# EAGLE design Plytka sterowania (EAGLE 4.11)
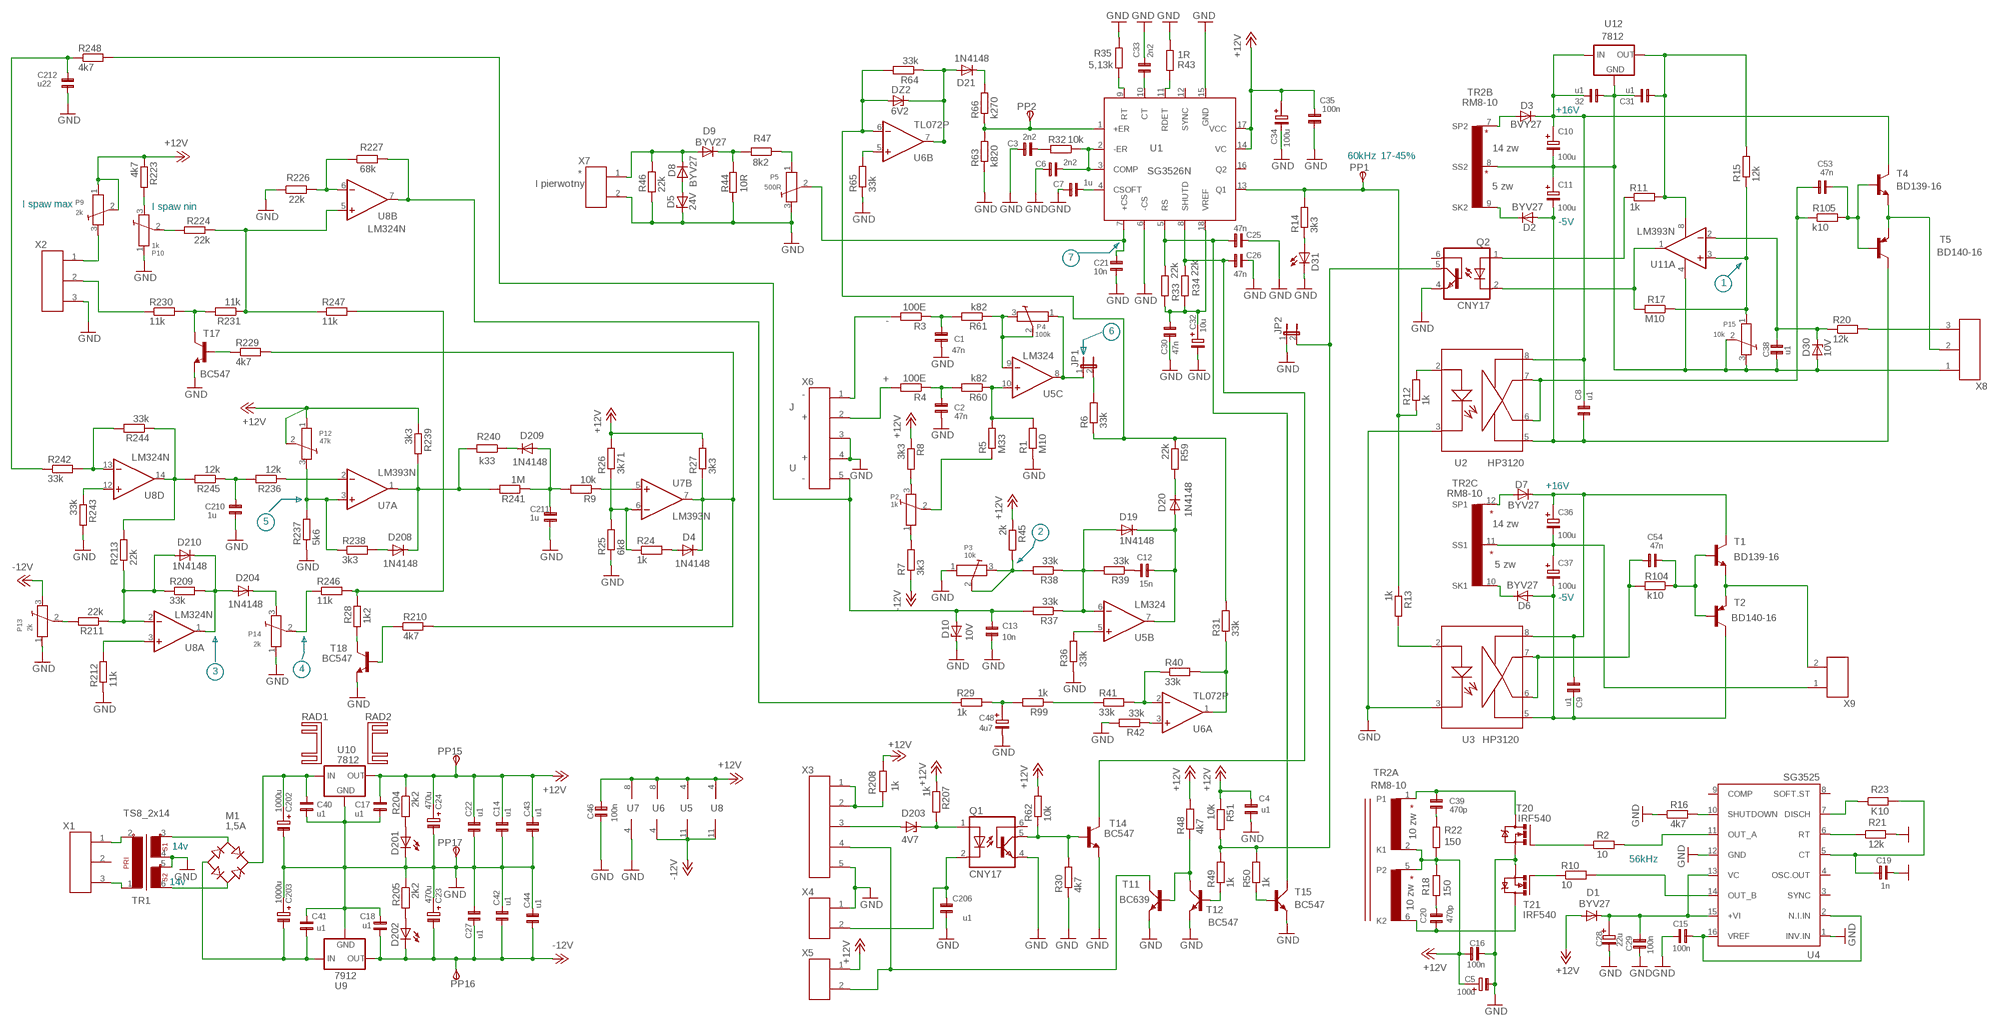
[diagram p0: schematic, sheet 1]

## Parts
32  u1  C5B3  [C5B3]
C1  47n  C5B3  [C5B3]
C2  47n  C5B3  [C5B3]
C3  2n2  C7,5B3  [C7,5B3]
C4  u1  C5B3  [C5B3]
C5  100u  E5-6  [E5-6]
C6  2n2  C7,5B3  [C7,5B3]
C7  1u  C5B5  [C5B5]
C8  u1  C5B3  [C5B3]
C9  u1  C5B3  [C5B3]
C10  100u  E5-6  [E5-6]
C11  100u  E5-6  [E5-6]
C12  15n  C5B3  [C5B3]
C13  10n  C5B3  [C5B3]
C14  u1  C5B2,5A  [C5B2,5A]
C15  100n  C5B2,5  [C5B2,5]
C16  100n  C5B2,5  [C5B2,5]
C17  u1  C5B3,5  [C5B3,5]
C18  u1  C5B3,5  [C5B3,5]
C19  1n  C5B2,5  [C5B2,5]
C20  470p  C2,5-3  [C2,5-3]
C21  10n  C5B2,5  [C5B2,5]
C22  u1  C5B2,5A  [C5B2,5A]
C23  470u  E5-10,5  [E5-10,5]
C24  470u  E5-10,5  [E5-10,5]
C25  47n  C5B2,5  [C5B2,5]
C26  47n  C5B2,5  [C5B2,5]
C27  u1  C5B2,5A  [C5B2,5A]
C28  22u  E2,5-6  [E2,5-6]
C29  100n  C5B2,5  [C5B2,5]
C30  47n  C5B2,5  [C5B2,5]
C31  u1  C5B3  [C5B3]
C32  10u  E5-5  [E5-5]
C33  2n2  C7,5B3  [C7,5B3]
C34  100u  E5-6  [E5-6]
C35  100n  C5B2,5  [C5B2,5]
C36  100u  E5-6  [E5-6]
C37  100u  E5-6  [E5-6]
C38  u1  C5B3  [C5B3]
C39  470p  C2,5-3  [C2,5-3]
C40  u1  C5B3,5  [C5B3,5]
C41  u1  C5B3,5  [C5B3,5]
C42  u1  C5B2,5A  [C5B2,5A]
C43  u1  C5B2,5A  [C5B2,5A]
C44  u1  C5B2,5A  [C5B2,5A]
C46  100n  C5B2,5  [C5B2,5]
C48  4u7  E2,5-5  [E2,5-5]
C53  47n  C5B3  [C5B3]
C54  47n  C5B3  [C5B3]
C202  1000u  E5-13  [E5-13]
C203  1000u  E5-13  [E5-13]
C206  u1  C5B3  [C5B3]
C210  1u  C5B5  [C5B5]
C211  1u  C5B5  [C5B5]
C212  u22  C5B3  [C5B3]
D1  BYV27  [SOD57-10]
D2  BYV27  [SOD57-10]
D3  BVY27  BYV27  [SOD57-10]
D4  1N4148  [DO35-10]
D5  24V  ZENER-DIODEDO41Z10  [DO41Z10]
D6  BYV27  [SOD57-10]
D7  BYV27  [SOD57-10]
D8  BYV27  [SOD57-10]
D9  BYV27  [SOD57-10]
D10  10V  ZENER-DIODEDO41Z10  [DO41Z10]
D19  1N4148  [DO35-10]
D20  1N4148  [DO35-10]
D21  1N4148  [DO35-10]
D30  10V  ZENER-DIODEDO41Z10  [DO41Z10]
D31  LED5MM  [LED5MM]
D201  LED5MM  [LED5MM]
D202  LED5MM  [LED5MM]
D203  4V7  ZENER-DIODEDO41Z10  [DO41Z10]
D204  1N4148  [DO35-10]
D208  1N4148  [DO35-10]
D209  1N4148  [DO35-10]
D210  1N4148  [DO35-10]
DZ2  6V2  ZENER-DIODEDO41Z10  [DO41Z10]
JP1  JP1E  [JP1]
JP2  JP1E  [JP1]
M1  1,5A  RECTIFIER-RB1A  [RB1A]
P2  1k  POT_MONT_W64_V  [W64_V]
P3  10k  POT_MONT_W64_V  [W64_V]
P4  100k  POT_MONT_W64_V  [W64_V]
P5  500R  POT_MONT_W64_V  [W64_V]
P9  2k  POT_MONT_W64_V  [W64_V]
P10  1k  POT_MONT_W64_V  [W64_V]
P12  47k  POT_MONT_W64_V  [W64_V]
P13  2k  POT_MONT_W64_V  [W64_V]
P14  2k  POT_MONT_W64_V  [W64_V]
P15  10k  POT_MONT_W64_V  [W64_V]
PP1  TPSPAD1-17  [P1-17]
PP2  TPSPAD1-17  [P1-17]
PP15  TPSPAD1-17  [P1-17]
PP16  TPSPAD1-17  [P1-17]
PP17  TPSPAD1-17  [P1-17]
Q1  CNY17  [DIL06]
Q2  CNY17  [DIL06]
R1  M10  R-EU_0309/10  [0309/10]
R2  10  R-EU_0207/10  [0207/10]
R3  100E  R-EU_0309/10  [0309/10]
R4  100E  R-EU_0309/10  [0309/10]
R5  M33  R-EU_0309/10  [0309/10]
R6  33k  R-EU_0309/10  [0309/10]
R7  3k3  R-EU_0309/10  [0309/10]
R8  3k3  R-EU_0309/10  [0309/10]
R9  10k  R-EU_0309/10  [0309/10]
R10  10  R-EU_0207/12  [0207/12]
R11  1k  R-EU_0309/10  [0309/10]
R12  1k  R-EU_0309/10  [0309/10]
R13  1k  R-EU_0309/10  [0309/10]
R14  3k3  R-EU_0309/10  [0309/10]
R15  12k  R-EU_0309/10  [0309/10]
R16  4k7  R-EU_0207/10  [0207/10]
R17  M10  R-EU_0309/10  [0309/10]
R18  150  R-EU_0207/10  [0207/10]
R20  12k  R-EU_0309/10  [0309/10]
R21  12k  R-EU_0207/10  [0207/10]
R22  150  R-EU_0207/10  [0207/10]
R23  K10  R-EU_0207/10  [0207/10]
R24  1k  R-EU_0309/10  [0309/10]
R25  6k8  R-EU_0309/10  [0309/10]
R26  3k71  R-EU_0309/10  [0309/10]
R27  3k3  R-EU_0309/10  [0309/10]
R28  1k2  R-EU_0309/10  [0309/10]
R29  1k  R-EU_0309/10  [0309/10]
R30  4k7  R-EU_0309/10  [0309/10]
R31  33k  R-EU_0309/10  [0309/10]
R32  10k  R-EU_0309/10  [0309/10]
R33  22k  R-EU_0309/10  [0309/10]
R34  22k  R-EU_0309/10  [0309/10]
R35  5,13k  R-EU_0309/10  [0309/10]
R36  33k  R-EU_0309/10  [0309/10]
R37  33k  R-EU_0309/10  [0309/10]
R38  33k  R-EU_0309/10  [0309/10]
R39  33k  R-EU_0309/10  [0309/10]
R40  33k  R-EU_0309/10  [0309/10]
R41  33k  R-EU_0309/10  [0309/10]
R42  33k  R-EU_0309/10  [0309/10]
R43  1R  R-EU_0309/10  [0309/10]
R44  10R  R-EU_0411/15  [0411/15]
R45  2k  R-EU_0309/10  [0309/10]
R46  22k  R-EU_0309/12  [0309/12]
R47  8k2  R-EU_0309/10  [0309/10]
R48  4k7  R-EU_0309/10  [0309/10]
R49  1k  R-EU_0309/10  [0309/10]
R50  1k  R-EU_0309/10  [0309/10]
R51  10k  R-EU_0309/10  [0309/10]
R59  22k  R-EU_0309/10  [0309/10]
R60  k82  R-EU_0309/10  [0309/10]
R61  k82  R-EU_0309/10  [0309/10]
R62  10k  R-EU_0309/10  [0309/10]
R63  k820  R-EU_0309/10  [0309/10]
R64  33k  R-EU_0309/10  [0309/10]
R65  33k  R-EU_0309/10  [0309/10]
R66  k270  R-EU_0309/10  [0309/10]
R99  1k  R-EU_0309/10  [0309/10]
R104  k10  R-EU_0309/10  [0309/10]
R105  k10  R-EU_0309/10  [0309/10]
R204  2k2  R-EU_0309/10  [0309/10]
R205  2k2  R-EU_0309/10  [0309/10]
R207  1k  R-EU_0309/10  [0309/10]
R208  1k  R-EU_0309/10  [0309/10]
R209  33k  R-EU_0309/10  [0309/10]
R210  4k7  R-EU_0309/10  [0309/10]
R211  22k  R-EU_0309/10  [0309/10]
R212  11k  R-EU_0309/10  [0309/10]
R213  22k  R-EU_0309/10  [0309/10]
R223  4k7  R-EU_0309/10  [0309/10]
R224  22k  R-EU_0309/10  [0309/10]
R226  22k  R-EU_0309/10  [0309/10]
R227  68k  R-EU_0309/10  [0309/10]
R229  4k7  R-EU_0309/10  [0309/10]
R230  11k  R-EU_0309/10  [0309/10]
R231  11k  R-EU_0309/10  [0309/10]
R236  12k  R-EU_0309/10  [0309/10]
R237  5k6  R-EU_0309/10  [0309/10]
R238  3k3  R-EU_0309/10  [0309/10]
R239  3k3  R-EU_0309/10  [0309/10]
R240  k33  R-EU_0309/10  [0309/10]
R241  1M  R-EU_0309/10  [0309/10]
R242  33k  R-EU_0309/10  [0309/10]
R243  33k  R-EU_0309/10  [0309/10]
R244  33k  R-EU_0309/10  [0309/10]
R245  12k  R-EU_0309/10  [0309/10]
R246  11k  R-EU_0309/10  [0309/10]
R247  11k  R-EU_0309/10  [0309/10]
R248  4k7  R-EU_0309/10  [0309/10]
RAD1  22-5-32  [22-5-32]
RAD2  22-5-32  [22-5-32]
T1  BD139-16  -NPN-TO126V  [TO126V]
T2  BD140-16  -PNP-TO126V  [TO126V]
T4  BD139-16  -NPN-TO126V  [TO126V]
T5  BD140-16  -PNP-TO126V  [TO126V]
T11  BC639  [SOT54D]
T12  BC547  [SOT54A]
T14  BC547  BC548  [TO92-EBC]
T15  BC547  [SOT54A]
T17  BC547  BC548  [TO92-EBC]
T18  BC547  BC548  [TO92-EBC]
T20  IRF540  IRF740  [TO220BV]
T21  IRF540  IRF740  [TO220BV]
TR1  TS8_2x14  TS2X12_6VA  [TS2X12_6VA]
TR2  RM8-10  RM8-12  [RM8-12A]
U1  SG3526N  [DIL18]
U2  HP3120  TLP250  [DIL8]
U3  HP3120  TLP250  [DIL8]
U4  SG3525  [DIL16]
U5  LM324  LM324N  [DIL14]
U6  TL072P  [DIL08]
U7  LM393N  [DIL08]
U8  LM324N  [DIL14]
U9  7912  79XXS  [79XXS]
U10  7812  78XXS  [78XXS]
U11  LM393N  [DIL08]
U12  7812  78XXS  [78XXS]
X1  ZK_3  [ZK_3]
X2  ZK_3  [ZK_3]
X3  ZK_5  [ZK_5]
X4  ZK_2  [ZK_2]
X5  ZK_2  [ZK_2]
X6  ZK_5  [ZK_5]
X7  ZK_2  [ZK_2]
X8  ZK_3  [ZK_3]
X9  ZK_2  [ZK_2]

## Nets
+12V: C4.2 C5.+ C14.2 C16.1 C17.2 C22.2 C24.+ C34.+ C35.1 C43.2 C46.2 D1.A P9.1 P9.2 P12.1 P12.2 PP15.1(PP) R8.1 R18.1 R22.2 R26.2 R27.2 R45.1 R48.2 R51.1 R62.2 R204.1 R207.1 R208.1 R223.1 R239.1 TR2.2(A:K1) TR2.5(A:P2) U1.14(VC) U1.17(VCC) U5.4(P:V+) U6.8(P:V+) U7.8(P:V+) U8.4(P:V+) U10.OUT X5.1
-12V: C18.2 C23.- C27.1 C42.1 C44.1 D202.K(C) P13.3 PP16.1(PP) R7.1 U5.11(P:V-) U6.4(P:V-) U8.11(P:V-) U9.OUT
D204: D204.C P14.3
GND: C1.1 C2.1 C3.1 C4.1 C5.- C6.1 C7.1 C13.2 C14.1 C15.2 C16.2 C17.1 C18.1 C19.2 C21.1 C22.1 C23.+ C24.- C25.2 C26.2 C27.2 C28.- C29.1 C30.2 C32.- C33.2 C34.- C35.2 C40.1 C41.2 C42.2 C43.1 C44.2 C46.1 C48.- C202.- C203.+ C206.1 C210.1 C211.1 C212.1 D5.C D10.C D31.K(C) D201.K(C) JP2.1 P3.1 P5.3 P10.1 P13.1 P14.1 PP17.1(PP) Q1.4(EMI) Q2.4(EMI) R1.1 R16.1 R21.2 R25.1 R30.1 R35.1 R36.1 R42.2 R43.1 R44.2 R46.1 R63.1 R65.1 R205.1 R212.1 R226.1 R237.1 R243.2 T11.E T12.E T14.E T15.E T17.E T18.E T20.S T21.S TR1.4 TR1.5 U1.6(-CS) U1.15(GND) U2.3 U3.3 U4.1(INV.IN) U4.12(GND) U7.4(P:V-) U9.GND U10.GND X2.3 X3.5 X4.1 X6.3 X6.4 X7.2
N$1: C212.2 R242.1 R248.1
N$2: PP2.1(PP) R63.2 R66.1 U1.1(+ER)
N$3: R236.1 U7.2(A:-IN)
N$4: R9.1 U7.5(B:+IN)
N$5: R24.1 R25.2 R26.1 U7.6(B:-IN)
N$6: D4.A R24.2
N$7: R208.2 X3.1 X3.2
N$8: D201.A R204.2
N$9: R28.2 T18.C
N$10: R210.1 T18.B
N$11: D4.C R27.1 R210.2 R229.2 U7.7(B:OUT)
N$12: D203.A X3.3
N$13: C6.2 R32.1 U1.2(-ER) U1.3(COMP)
N$14: C7.2 U1.4(CSOFT)
N$15: C3.2 R32.2
N$16: C21.2 P5.2 U1.7(+CS)
N$17: C25.1 R33.2 T15.C U1.5(RS)
N$18: C26.1 R34.2 T14.C U1.8(SHUTD)
N$19: C30.1 C32.+ R33.1 R34.1 U1.18(VREF)
N$20: R35.2 U1.9(RT)
N$21: R230.1 X2.2
N$22: R212.2 U8.3(A:+IN)
N$23: C33.1 U1.10(CT)
N$24: R43.2 U1.11(RDET)
N$25: D21.C R66.2
N$26: D208.A R238.2
N$27: R65.2 U6.5(B:+IN)
N$28: D2.C TR2.9(B:SK2)
N$29: D8.C D9.A R46.2 X7.1
N$30: D3.A TR2.7(B:SP2)
N$31: R230.2 R231.2 T17.C
N$32: P9.3 X2.1
N$33: P10.3 R223.2
N$34: R224.1 R231.1 R247.1 U8.5(B:+IN)
N$35: R226.2 R227.1 U8.6(B:-IN)
N$36: R13.2 U3.2
N$37: D202.A R205.2
N$38: R242.2 R244.2 U8.13(D:-IN)
N$39: R243.1 U8.12(D:+IN)
N$40: D209.C R240.1
N$41: R213.2 R244.1 R245.2 U8.14(D:OUT)
N$42: C210.2 R236.2 R245.1
N$43: PP1.1(PP) R12.1 R13.1 R14.2 U1.13(Q1)
N$44: D208.C R239.2 R240.2 R241.2 U7.1(A:OUT)
N$45: P12.3 R237.2 R238.1 U7.3(A:+IN)
N$46: C211.2 D209.A R9.2 R241.1
N$47: P10.2 R224.2
N$49: R229.1 T17.B
N$50: P13.2 R211.2
N$51: D210.A R209.1 R211.1 R213.1 U8.2(A:-IN)
N$52: D6.C TR2.10(C:SK1)
N$54: D204.A D210.C R209.2 U8.1(A:OUT)
N$55: P14.2 R246.1
N$56: R28.1 R246.2 R247.2
N$57: D5.A D8.A
N$58: DZ2.A R6.1 R31.2 R59.1 R64.2 U6.6(B:-IN)
N$59: D7.A TR2.12(C:SP1)
N$60: C20.2 R18.2
N$61: C54.1 R104.2 U3.6 U3.7
N$62: C20.1 T21.D TR2.6(A:K2)
N$63: P2.1 R7.2
N$64: D9.C R44.1 R47.2
N$65: C39.2 T20.D TR2.1(A:P1)
N$66: C39.1 R22.1
N$67: R21.1 U4.6(RT)
N$68: R2.1 T20.G
N$69: P5.1 R47.1
N$70: R10.1 T21.G
N$71: R16.2 U4.10(SHUTDOWN)
N$72: R2.2 U4.11(OUT_A)
N$73: T11.C X3.4 X5.2
N$74: D21.A DZ2.C R64.1 U6.7(B:OUT)
N$75: R48.1 T11.B T12.C
N$76: R49.1 T12.B
N$77: R50.1 T15.B
N$78: JP2.2 Q2.5(COL) R49.2 R50.2 R51.2
N$79: M1.AC1 TR1.3
N$80: M1.AC2 TR1.6
N$81: TR1.1 X1.3
N$82: TR1.2 X1.1
N$85: D20.C R59.2
N$88: D31.A R14.1
N$90: R10.2 U4.14(OUT_B)
N$96: JP1.2 R6.2
N$97: C12.2 R39.1
N$98: JP1.1 P4.1 U5.8(C:OUT)
N$99: P3.2 P3.3 R38.2 R45.2
N$100: P4.2 P4.3 R61.1 U5.9(C:-IN)
N$101: P2.3 R8.2
N$103: C2.2 R4.1 R60.2
N$104: R1.2 R5.2 R60.1 U5.10(C:+IN)
N$105: P2.2 R5.1
N$107: R3.2 X6.1
N$108: D19.A R37.1 R38.1 R39.2 U5.6(B:-IN)
N$110: C12.1 D19.C D20.A U5.7(B:OUT)
N$112: C19.1 R23.2 U4.5(CT)
N$113: C48.+ R29.2 R99.2
N$114: R36.2 U5.5(B:+IN)
N$115: R41.1 R99.1
N$116: R40.1 R41.2 U6.2(A:-IN)
N$117: R42.1 U6.3(A:+IN)
N$118: R31.1 R40.2 U6.1(A:OUT)
N$120: Q1.5(COL) R30.2 R62.1 T14.B
N$121: R29.1 R227.2 U8.7(B:OUT)
N$123: C15.1 U4.2(N.I.IN) U4.16(VREF)
N$126: R23.1 U4.7(DISCH)
N$131: D203.C Q1.1(A) R207.2
N$132: C206.2 Q1.2(C) X4.2
N$133: C28.+ C29.2 D1.C U4.13(VC) U4.15(+VI)
N$139: C38.1 D30.C R20.1 U11.2(A:-IN)
N$140: 32.2 C8.2 C10.+ D3.C T4.2(C) U2.8 U12.IN
N$141: C8.1 C11.- D2.A T5.2(C) U2.5
N$142: C31.1 R11.2 R15.2 U11.8(P:V+) U12.OUT
N$143: Q2.1(A) R11.1
N$144: Q2.2(C) R17.2 U11.1(A:OUT)
N$145: P15.1 R15.1 R17.1 U11.3(A:+IN)
N$146: 32.1 C10.- C11.+ C31.2 C38.2 D30.A P15.2 P15.3 TR2.8(B:SS2) U11.4(P:V-) U12.GND X8.1
N$147: C53.1 R105.1 U2.6 U2.7
N$148: C53.2 R105.2 T4.3(B) T5.3(B)
N$149: R20.2 X8.3
N$151: T4.1(E) T5.1(E) X8.2
N$152: R4.2 X6.2
N$153: R12.2 U2.2
N$155: C36.- C37.+ TR2.11(C:SS1) X9.1
N$157: C9.1 C36.+ D7.C T1.2(C) U3.8
N$158: C9.2 C37.- D6.A T2.2(C) U3.5
N$160: T1.1(E) T2.1(E) X9.2
N$162: C54.2 R104.1 T1.3(B) T2.3(B)
N$167: C40.2 C202.+ M1.+ U10.IN
N$168: C41.1 C203.- M1.- U9.IN
R30: C1.2 R3.1 R61.2
XE6: C13.1 D10.A R37.2 R248.2 X6.5
Unconnected: Q1.6(BAS) Q2.6(BAS) U1.12(SYNC) U1.16(Q2) U4.3(SYNC) U4.4(OSC.OUT) U4.8(SOFT.ST) U4.9(COMP) U5.1(A:OUT) U5.2(A:-IN) U5.3(A:+IN) U5.12(D:+IN) U5.13(D:-IN) U5.14(D:OUT) U8.8(C:OUT) U8.9(C:-IN) U8.10(C:+IN) U11.5(B:+IN) U11.6(B:-IN) U11.7(B:OUT) X1.2

## Notes on the sheet
- +16V
- 14 zw
- 60kHz | 17-45%
- *
- I pierwotny | 5 zw
- I spaw max | I spaw nin
- -5V
- 7
- 1
- -
- 6
- +
- -
- J
- +
- +
- U
- -
- +16V
- 5 | 14 zw
- 2
- 5 zw
- -5V
- 3 | 4
- U7 | U6 | U5 | U8
- 10 zw
- 14v
- 56kHz
- 14v
- 10 zw

## Library data of the parts
32 C1 C2 C4 C8 C9 C12 C13 C31 C38 C53 C54 C206 C212 = condensatory_2:C5B3
C3 C6 C33 = condensatory_2:C7,5B3
C5 C10 C11 C34 C36 C37 = elektrolity:E5-6
C7 C210 C211 = condensatory_2:C5B5
C14 C22 C27 C42-C44 = condensatory_2:C5B2,5A
C15 C16 C19 C21 C25 C26 C29 C30 C35 C46 = condensatory_2:C5B2,5
C17 C18 C40 C41 = condensatory_2:C5B3,5
C20 C39 = condensatory_2:C2,5-3
C23 C24 = elektrolity:E5-10,5
C28 = elektrolity:E2,5-6
C32 = elektrolity:E5-5
C48 = elektrolity:E2,5-5
C202 C203 = elektrolity:E5-13
D1-D3 D6-D9 = diode:BYV27: DIODE ultra fast
D4 D19-D21 D204 D208-D210 = diode:1N4148: DIODE high speed (Philips)
D5 D10 D30 D203 DZ2 = diode:ZENER-DIODE: Z-Diode
D31 D201 D202 = led:LED: LED OSRAM: - CHIPLED LG R971, LG N971, LY N971, LG Q971, LY Q971, LO R971, LY R971 LH N974, LH R974 LS Q976, LO Q976, LY Q976 LO Q996 - Hyper CHIPLED LW Q18S LB Q993, LB Q99A, LB R99A - SideLED LS A670, LO A670, LY A670, LG A670, LP A670 LB A673, LV A673, LT A673, LW A673 LH A674 LY A675 LS A676, LA A676, LO A676, LY A676, LW A676 LS A679, LY A679, LG A679 - Hyper Micro SIDELED® LS Y876, LA Y876, LO Y876, LY Y876 LT Y87S - SmartLED LW L88C, LW L88S LB L89C, LB L89S, LG L890 LS L89K, LO L89K, LY L89K LS L896, LA L896, LO L896, LY L896 - TOPLED LS T670, LO T670, LY T670, LG T670, LP T670 LSG T670, LSP T670, LSY T670, LOP T670, LYG T670 LG T671, LOG T671, LSG T671 LB T673, LV T673, LT T673, LW T673 LH T674 LS T676, LA T676, LO T676, LY T676, LB T676, LH T676, LSB T676, LW T676 LB T67C, LV T67C, LT T67C, LS T67K, LO T67K, LY T67K, LW E67C LS E67B, LA E67B, LO E67B, LY E67B, LB E67C, LV E67C, LT E67C LW T67C LS T679, LY T679, LG T679 LS T770, LO T770, LY T770, LG T770, LP T770 LB T773, LV T773, LT T773, LW T773 LH T774 LS E675, LA E675, LY E675, LS T675 LS T776, LA T776, LO T776, LY T776, LB T776 LHGB T686 LT T68C, LB T68C - Hyper Mini TOPLED® LB M676 - Mini TOPLED Santana® LG M470 LS M47K, LO M47K, LY M47K Source: http://www.osram.convergy.de/
JP1 JP2 = gold_piny:JP1E
M1 = rectifier:RECTIFIER-: Rectifier
P2-P5 P9 P10 P12-P15 = moje-elementy:POT_MONT_W64_V
PP1 PP2 PP15-PP17 = testpad:TPS: TEST PIN
Q1 Q2 = optocoupler:CNY17: SIEMENS OPTO COUPLER
R1-R18 R20-R51 R59-R66 R99 R104 R105 R204 R205 R207-R213 R223 R224 R226 R227 R229-R231 R236-R248 = rcl:R-EU_: RESISTOR, European symbol
RAD1 RAD2 = heatsink:22-5-32
T1 T4 = transistor:*-NPN-: NPN Transistror
T2 T5 = transistor:*-PNP-: PNP Transistror
T11 = transistor-small-signal:BC639: NPN TRANSISTOR
T12 T15 = transistor-small-signal:BC547: NPN TRANSISTOR
T14 T17 T18 = transistor-npn:BC548*: NPN Transistor
T20 T21 = transistor-power:IRF740: N-CHANNEL MOS FET
TR1 = trafo:TS2X12_6VA
TR2 = trafo-siemens:RM8-12
U1 = linear:SG3526N
U2 U3 = moje-elementy:TLP250
U4 = linear:SG3525
U5 U8 = linear:LM324: OP AMP
U6 = linear:TL072: OP AMP
U7 U11 = linear:LM393: COMPARATOR
U9 = v-reg:79XXS: VOLTAGE REGULATOR
U10 U12 = v-reg:78XXS: VOLTAGE REGULATOR
X1 X2 X8 = moje-elementy:ZK_3
X3 X6 = moje-elementy:ZK_5
X4 X5 X7 X9 = moje-elementy:ZK_2

## Net classes
0 default: width 0.254 mm, drill 0.254 mm, clearance 0.254 mm

## Board
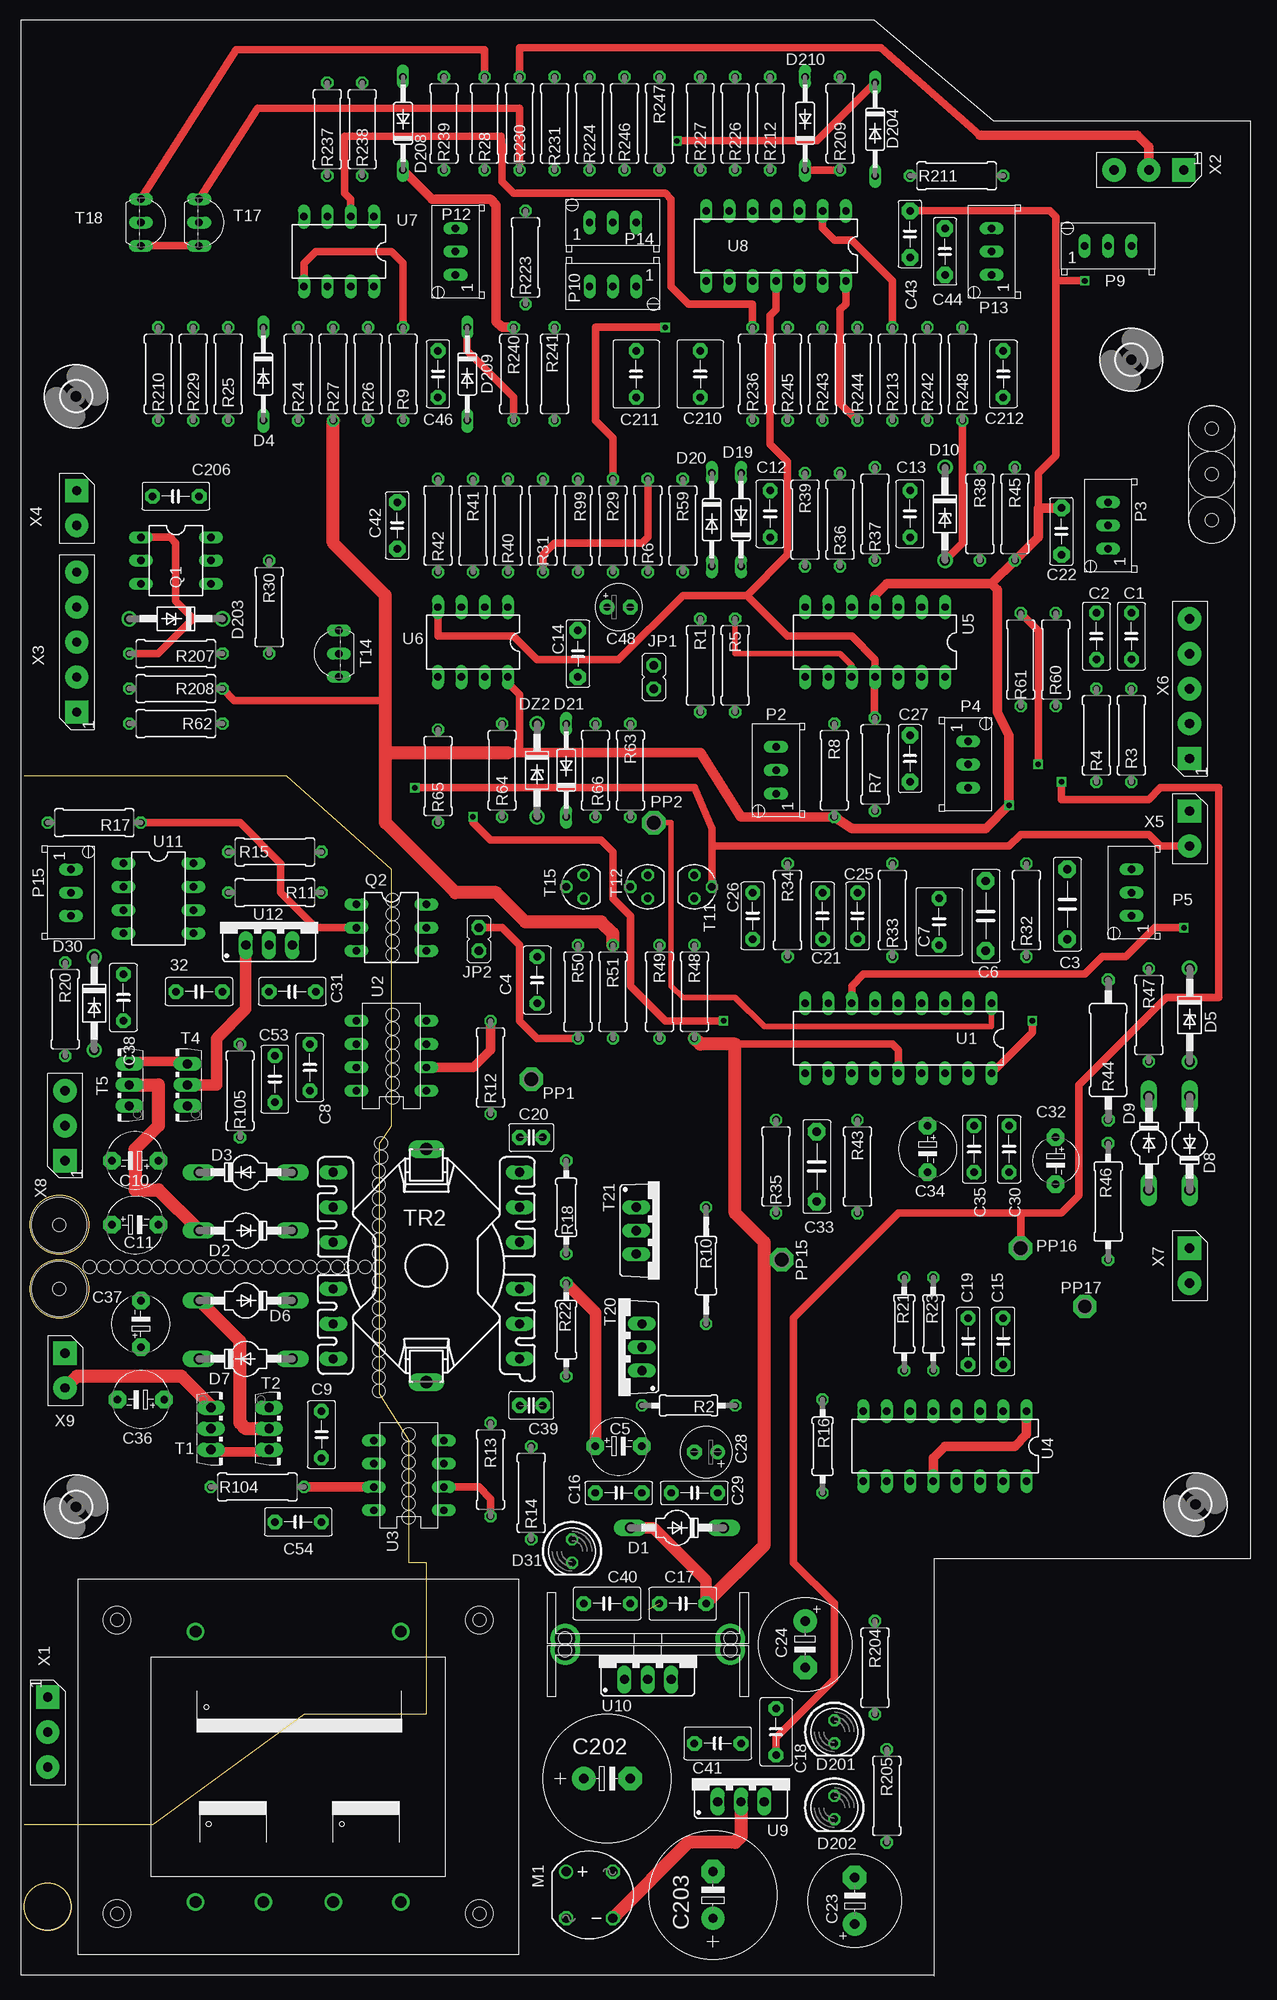
[diagram p1: board, top side]
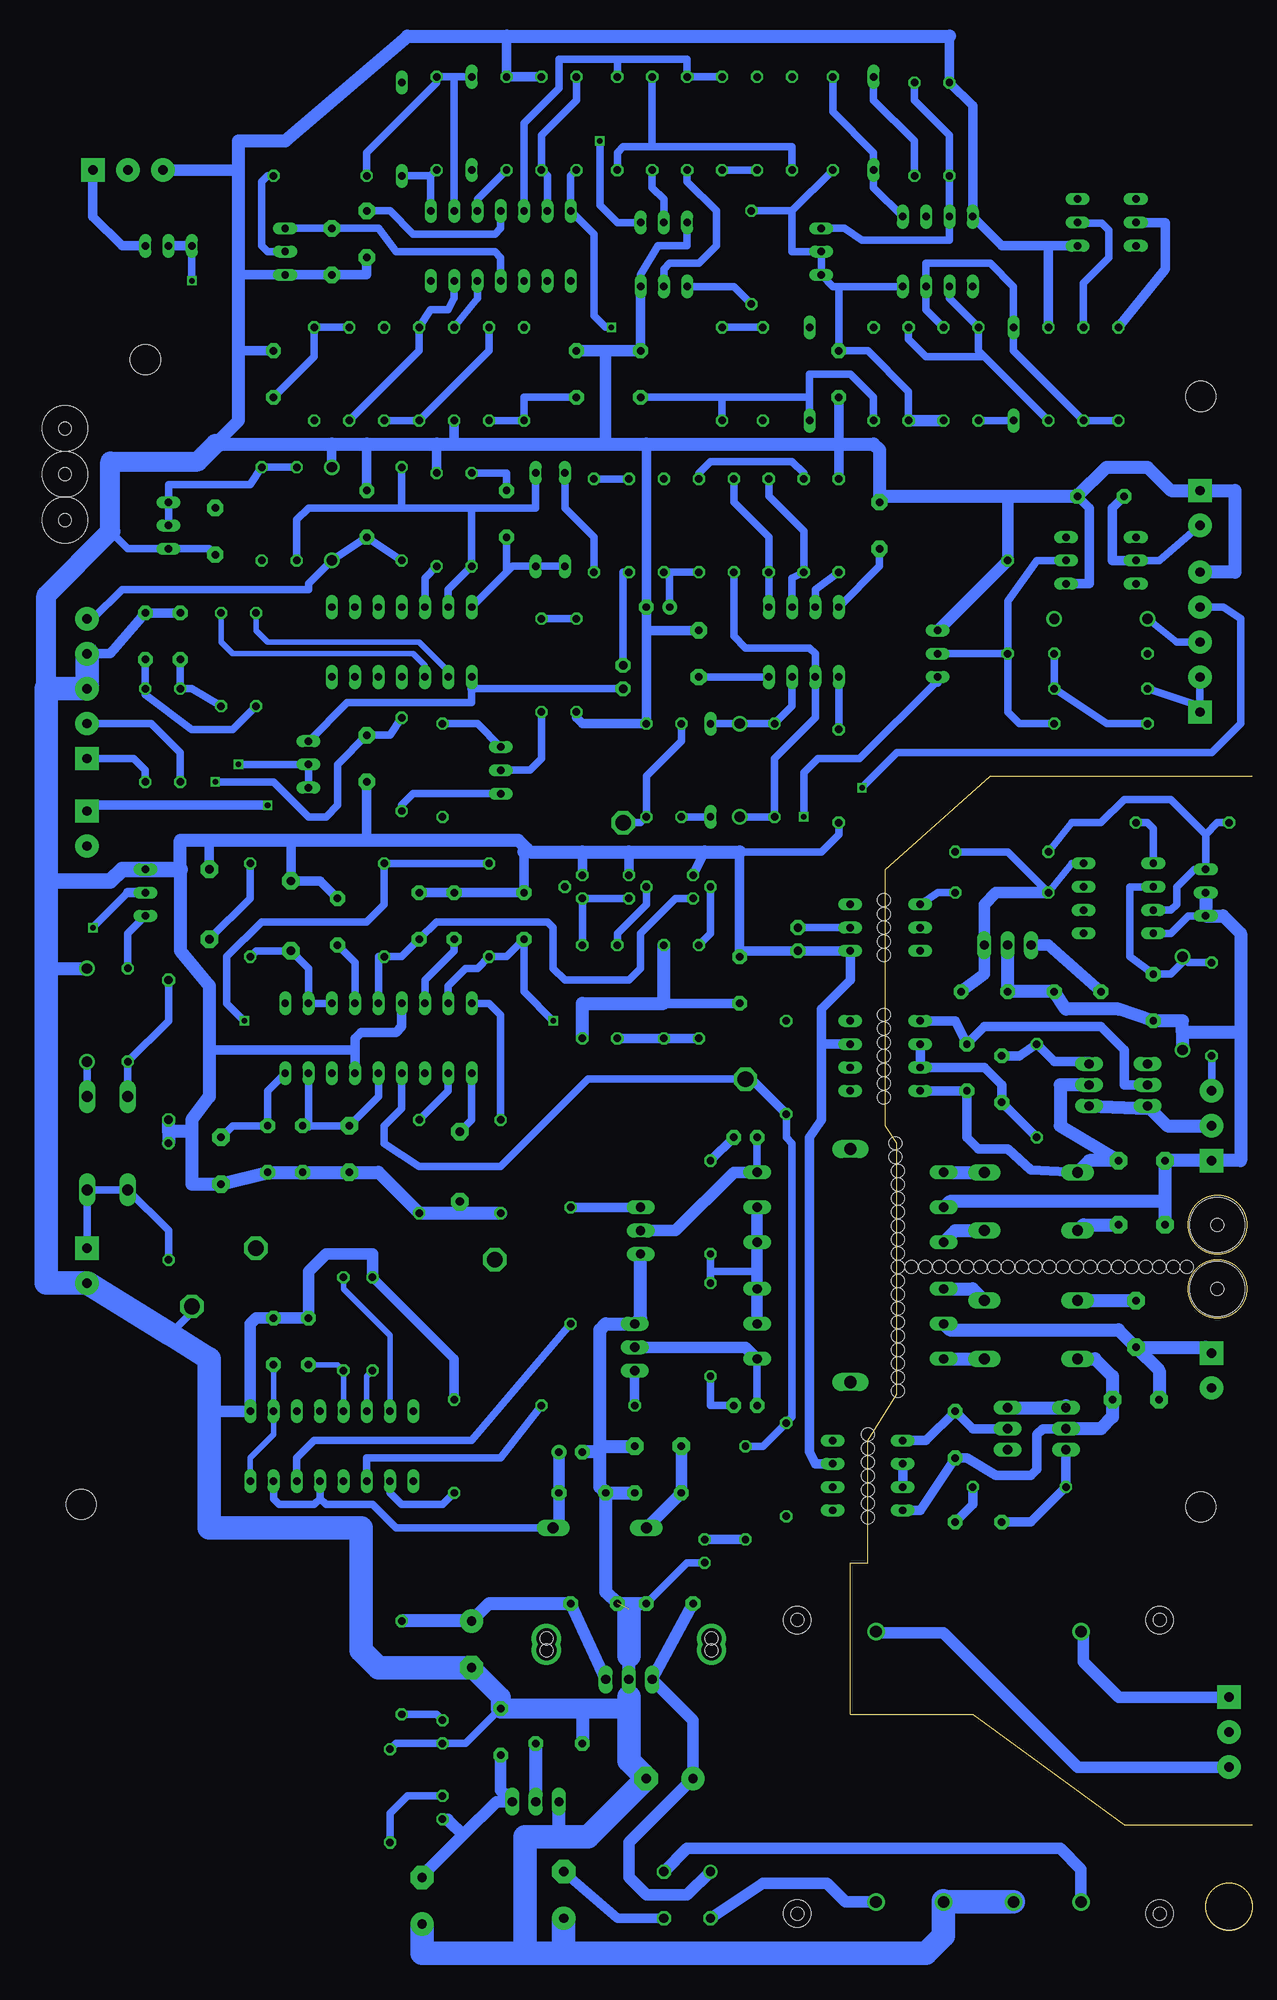
[diagram p2: board, bottom side, seen from below]

Size 43.81 x 114.3 mm. Coordinates in mm from the lower left corner, seen from the top.
Outline: 0,0 13.97,0 30.48,12.06 43.81,12.06 43.81,28.58 41.91,28.58 41.91,41.91 38.73,46.99 38.73,74.3 40,76.2 40,104.14 28.58,114.3 0,114.3
Copper layers (1*16): Top 0.035mm / dielectric 1.5mm / Bottom 0.035mm
Design rules "default": minimum track width 10mil, minimum drill 24mil, track to track 8mil, track to pad 8mil, pad to pad 8mil, via to via 8mil, smd to smd 8mil, copper to edge 40mil, drill to drill 8mil, minimum pad ring 10mil, minimum via ring 8mil, stop-mask expansion 4mil, vias tented up to drill 0mil, thermal gap 10mil
Holes 5.08 mm at 2.54,-8.89
Holes 5 mm at 129.41,147.18 129.41,142.18 129.41,152.18
Holes 1.42 mm at 129.41,152.18 129.41,147.18 129.41,142.18 40.13,97.8 40.13,99.3 40.13,100.8 40.13,96.3 40.13,94.8 40.13,83.8 40.13,85.3 40.13,86.8 40.13,88.3 40.13,82.3 40.13,80.8 40.13,79.3 38.88,74.3 38.88,72.8 38.63,71.3 38.63,69.8 38.63,68.3 38.63,66.8 38.63,65.3 38.63,63.8 38.63,62.3 38.63,60.8 38.63,59.3 38.63,57.8 38.63,56.3 38.63,54.8 38.63,53.3 38.63,51.8 38.63,50.3 38.63,48.8 38.63,47.3 37.13,60.8 35.63,60.8 34.13,60.8 32.63,60.8 31.14,60.8 29.64,60.8 28.14,60.8 26.64,60.8 25.14,60.8 23.64,60.8 22.14,60.8 20.64,60.8 19.14,60.8 17.64,60.8 16.14,60.8 14.63,60.8 13.13,60.8 11.63,60.8 10.13,60.8 8.63,60.8 7.13,60.8 41.88,38.05 41.88,39.55 41.88,41.05 41.88,42.55 41.88,36.55 41.88,35.05 41.88,33.55 3.81,65.41 3.81,58.42
Holes 6 mm at 3.81,65.41 3.81,58.42
Milling: area 0.6,62.2 to 7,68.6; area 0.6,55.2 to 7,61.6; area 0,-11.4 to 5.1,-6.3

### Footprints (pad centres in the part's own frame; a part is rotated, then mirrored left to right if it is on the bottom)
C5B3 = drill 0.813 pad 1.6 octagon: 1 -2.54,0; 2 2.54,0
C7,5B3 = drill 0.914 pad 1.905 octagon: 1 -3.81,0; 2 3.81,0
E5-6 = drill 0.813 pad 1.905 octagon: + -2.54,0; - 2.54,0
C5B5 = drill 0.813 pad 1.6 octagon: 1 -2.54,0; 2 2.54,0
C5B2,5A = drill 0.813 pad 1.778 octagon: 1 -2.54,0; 2 2.54,0
C5B2,5 = drill 0.813 pad 1.6 octagon: 1 -2.54,0; 2 2.54,0
C5B3,5 = drill 0.813 pad 1.6 octagon: 1 -2.54,0; 2 2.54,0
C2,5-3 = drill 0.813 pad 1.6 octagon: 1 -1.27,0; 2 1.27,0
E5-10,5 = drill 1.016 pad 2.54 round: + -2.54,0 | drill 1.016 pad 2.54 octagon: - 2.54,0
E2,5-6 = drill 0.813 pad 1.6 round: + -1.27,0 | drill 0.813 pad 1.6 octagon: - 1.27,0
E5-5 = drill 0.813 pad 1.905 octagon: + -2.54,0; - 2.54,0
E2,5-5 = drill 0.813 pad 1.6 round: + -1.27,0 | drill 0.813 pad 1.6 octagon: - 1.27,0
E5-13 = drill 1.016 pad 2.54 round: + -2.54,0 | drill 1.016 pad 2.54 octagon: - 2.54,0
SOD57-10 = drill 1.194 long: A 5.08,0; C -5.08,0
DO35-10 = drill 0.813 long: A 5.08,0; C -5.08,0
DO41Z10 = drill 1.118 round: A 5.08,0; C -5.08,0
LED5MM = drill 0.813 octagon: A -1.27,0; K 1.27,0
JP1 = drill 0.914 pad 1.6 octagon: 1 0,-1.27; 2 0,1.27
RB1A = drill 1.016 round: + -2.54,2.54 | drill 1.016 octagon: - 2.54,-2.54; AC1 2.54,2.54; AC2 -2.54,-2.54
W64_V = drill 0.813 long: 1 -2.54,0; 2 0,0; 3 2.54,0
P1-17 = drill 1.702 pad 2.54 octagon: 1 0,0
DIL06 = drill 0.813 long: 1 -2.54,-3.81; 2 0,-3.81; 3 2.54,-3.81; 4 2.54,3.81; 5 0,3.81; 6 -2.54,3.81
0309/10 = drill 0.813 octagon: 1 -5.08,0; 2 5.08,0
0207/10 = drill 0.813 octagon: 1 -5.08,0; 2 5.08,0
0207/12 = drill 0.813 octagon: 1 -6.35,0; 2 6.35,0
0411/15 = drill 0.914 octagon: 1 -7.62,0; 2 7.62,0
0309/12 = drill 0.813 octagon: 1 -6.35,0; 2 6.35,0
22-5-32 = drill 2.184 round: P$1 -9,0; P$2 9,0 | hole 1.422: -9,0; 9,0
TO126V = drill 1.016 long: 1 -2.286,-1.27; 2 0,-1.27; 3 2.286,-1.27
SOT54D = drill 0.813 octagon: B 1.27,0; C 0,1.905; E -1.27,0
SOT54A = drill 0.813 octagon: B 0,1.905; C -1.27,0; E 1.27,0
TO92-EBC = drill 0.813 long: B 0,-1.27; C -2.54,-1.27; E 2.54,-1.27
TO220BV = drill 1.016 long: D 0,-2.54; G -2.54,-2.54; S 2.54,-2.54
TS2X12_6VA = drill 1.27 round: 1 -14.732,11.176; 2 -14.732,-11.176; 3 14.732,-11.176; 4 14.732,-3.81; 5 14.732,3.81; 6 14.732,11.176 | hole 1.422: -16,-19.75; 16,-19.75; 16,19.75; -16,19.75 | hole 3: -16,19.75; 16,19.75; -16,-19.75; 16,-19.75
RM8-12A = drill 1.016 long: 1 -10.16,10.16; 2 -10.16,6.35; 3 -10.16,2.54; 4 -10.16,-2.54; 5 -10.16,-6.35; 6 -10.16,-10.16; 7 10.16,-10.16; 8 10.16,-6.35; 9 10.16,-2.54; 10 10.16,2.54; 11 10.16,6.35; 12 10.16,10.16 | drill 1.321 long: M 0,-12.7; M1 0,12.7
DIL18 = drill 0.813 long: 1 -10.16,-3.81; 2 -7.62,-3.81; 3 -5.08,-3.81; 4 -2.54,-3.81; 5 0,-3.81; 6 2.54,-3.81; 7 5.08,-3.81; 8 7.62,-3.81; 9 10.16,-3.81; 10 10.16,3.81; 11 7.62,3.81; 12 5.08,3.81; 13 2.54,3.81; 14 0,3.81; 15 -2.54,3.81; 16 -5.08,3.81; 17 -7.62,3.81; 18 -10.16,3.81
DIL8 = drill 0.813 long: 1 -3.81,-3.81; 2 -1.27,-3.81; 3 1.27,-3.81; 4 3.81,-3.81; 5 3.81,3.81; 6 1.27,3.81; 7 -1.27,3.81; 8 -3.81,3.81
DIL16 = drill 0.813 long: 1 -8.89,-3.81; 2 -6.35,-3.81; 3 -3.81,-3.81; 4 -1.27,-3.81; 5 1.27,-3.81; 6 3.81,-3.81; 7 6.35,-3.81; 8 8.89,-3.81; 9 8.89,3.81; 10 6.35,3.81; 11 3.81,3.81; 12 1.27,3.81; 13 -1.27,3.81; 14 -3.81,3.81; 15 -6.35,3.81; 16 -8.89,3.81
DIL14 = drill 0.813 long: 1 -7.62,-3.81; 2 -5.08,-3.81; 3 -2.54,-3.81; 4 0,-3.81; 5 2.54,-3.81; 6 5.08,-3.81; 7 7.62,-3.81; 8 7.62,3.81; 9 5.08,3.81; 10 2.54,3.81; 11 0,3.81; 12 -2.54,3.81; 13 -5.08,3.81; 14 -7.62,3.81
DIL08 = drill 0.813 long: 1 -3.81,-3.81; 2 -1.27,-3.81; 3 1.27,-3.81; 4 3.81,-3.81; 5 3.81,3.81; 6 1.27,3.81; 7 -1.27,3.81; 8 -3.81,3.81
79XXS = drill 1.016 long: GND -2.54,-2.54; IN 0,-2.54; OUT 2.54,-2.54
78XXS = drill 1.016 long: GND 0,-2.54; IN -2.54,-2.54; OUT 2.54,-2.54
3,3 = hole 3.3: 0,0
ZK_3 = drill 1.016 pad 2.54 square: 1 -3.81,0 | drill 1.016 pad 2.54 round: 2 0,0; 3 3.81,0
ZK_5 = drill 1.016 pad 2.54 square: 1 -7.62,0 | drill 1.016 pad 2.54 round: 2 -3.81,0; 3 0,0; 4 3.81,0; 5 7.62,0
ZK_2 = drill 1.016 pad 2.54 square: 1 -3.81,0 | drill 1.016 pad 2.54 round: 2 0,0

### Placement (x,y rotation side)
32  19.05,90.81 180 top
C1  120.65,129.54 270 top  (outside the outline)
C2  116.84,129.54 270 top  (outside the outline)
C3  113.67,100.33 270 top  (outside the outline)
C4  55.88,92.08 270 top  (outside the outline)
C5  64.77,41.28 0 top  (outside the outline)
C6  104.78,99.06 270 top  (outside the outline)
C7  99.7,98.42 270 top  (outside the outline)
C8  31.12,82.55 270 top
C9  32.38,42.55 90 top
C10  12.06,72.39 180 top
C11  12.06,65.41 0 top
C12  81.28,142.88 90 top  (outside the outline)
C13  96.52,142.88 90 top  (outside the outline)
C14  60.32,127.64 270 top  (outside the outline)
C15  106.68,52.7 90 top  (outside the outline)
C16  64.77,36.2 0 top  (outside the outline)
C17  71.76,24.13 0 top  (outside the outline)
C18  81.92,10.16 270 top  (outside the outline)
C19  102.87,52.7 90 top  (outside the outline)
C20  55.24,74.93 0 top  (outside the outline)
C21  87,99.06 270 top  (outside the outline)
C22  113.03,140.97 90 top  (outside the outline)
C23  90.5,-8.25 90 top  (outside the outline)
C24  85.09,19.69 270 top  (outside the outline)
C25  90.81,99.06 90 top  (outside the outline)
C26  79.38,99.06 90 top  (outside the outline)
C27  96.52,116.2 270 top  (outside the outline)
C28  74.3,40.64 180 top  (outside the outline)
C29  73.03,36.2 0 top  (outside the outline)
C30  107.32,73.66 270 top  (outside the outline)
C31  29.21,90.81 180 top
C32  112.4,72.39 270 top  (outside the outline)
C33  86.36,71.75 270 top  (outside the outline)
C34  98.43,73.66 270 top  (outside the outline)
C35  103.51,73.66 270 top  (outside the outline)
C36  12.7,46.36 180 top
C37  12.7,54.61 90 top
C38  10.79,90.17 270 top
C39  55.24,45.72 180 top  (outside the outline)
C40  63.5,24.13 180 top  (outside the outline)
C41  75.57,8.89 180 top  (outside the outline)
C42  40.64,141.61 90 top  (outside the outline)
C43  96.52,173.36 90 top  (outside the outline)
C44  100.33,171.45 270 top  (outside the outline)
C46  45.09,158.12 90 top  (outside the outline)
C48  64.77,132.72 0 top  (outside the outline)
C53  27.31,81.28 90 top
C54  29.85,33.02 180 top
C202  63.5,5.08 0 top  (outside the outline)
C203  75.05,-7.62 90 top  (outside the outline)
C206  16.51,144.78 180 top  (outside the outline)
C210  73.66,158.12 270 top  (outside the outline)
C211  66.68,158.12 270 top  (outside the outline)
C212  106.68,158.12 270 top  (outside the outline)
D1  71.12,32.39 180 top  (outside the outline)
D2  24.13,64.77 180 top
D3  24.13,71.12 0 top
D4  26.04,158.12 270 top  (outside the outline)
D5  127,88.27 270 top  (outside the outline)
D6  24.13,57.15 180 top
D7  24.13,50.8 0 top
D8  127,74.3 90 top  (outside the outline)
D9  122.56,74.3 270 top  (outside the outline)
D10  100.33,142.88 270 top  (outside the outline)
D19  78.11,142.24 90 top  (outside the outline)
D20  74.93,142.24 270 top  (outside the outline)
D21  59.05,114.94 90 top  (outside the outline)
D30  7.62,89.53 270 top
D31  59.69,29.84 270 top  (outside the outline)
D201  88.27,10.16 270 top  (outside the outline)
D202  88.27,1.91 270 top  (outside the outline)
D203  16.51,131.44 180 top  (outside the outline)
D204  92.71,184.78 270 top  (outside the outline)
D208  41.27,185.42 90 top  (outside the outline)
D209  48.26,158.12 270 top  (outside the outline)
D210  85.09,185.42 90 top  (outside the outline)
DZ2  55.88,114.94 270 top  (outside the outline)
JP1  68.58,125.09 0 top  (outside the outline)
JP2  49.53,96.52 0 top  (outside the outline)
M1  61.59,-7.62 0 top  (outside the outline)
P2  81.92,114.94 90 top  (outside the outline)
P3  118.11,141.61 90 top  (outside the outline)
P4  102.87,115.57 270 top  (outside the outline)
P5  120.65,101.6 90 top  (outside the outline)
P9  118.11,172.09 0 top  (outside the outline)
P10  64.14,167.64 180 top  (outside the outline)
P12  46.99,171.45 90 top  (outside the outline)
P13  105.41,171.45 90 top  (outside the outline)
P14  64.14,174.62 0 top  (outside the outline)
P15  5.08,101.6 270 top
PP1  55.24,81.28 180 top  (outside the outline)
PP2  68.58,109.22 180 top  (outside the outline)
PP15  82.55,61.59 0 top  (outside the outline)
PP16  108.59,62.87 0 top  (outside the outline)
PP17  115.57,56.52 0 top  (outside the outline)
Q1  16.51,137.8 270 top  (outside the outline)
Q2  40,97.79 270 top
R1  73.66,126.37 90 top  (outside the outline)
R2  72.39,45.72 0 top  (outside the outline)
R3  120.65,118.75 270 top  (outside the outline)
R4  116.84,118.75 270 top  (outside the outline)
R5  77.47,126.37 90 top  (outside the outline)
R6  67.95,141.61 270 top  (outside the outline)
R7  92.71,115.57 270 top  (outside the outline)
R8  88.27,114.94 90 top  (outside the outline)
R9  41.27,158.12 270 top  (outside the outline)
R10  74.3,60.96 270 top  (outside the outline)
R11  27.31,101.6 180 top
R12  50.8,82.55 90 top  (outside the outline)
R13  50.8,38.73 270 top  (outside the outline)
R14  55.24,36.2 90 top  (outside the outline)
R15  27.31,106.05 0 top
R16  87,41.28 270 top  (outside the outline)
R17  7.62,109.22 0 top
R18  59.05,67.31 90 top  (outside the outline)
R20  4.45,88.9 270 top
R21  95.89,54.61 90 top  (outside the outline)
R22  59.05,53.98 90 top  (outside the outline)
R23  99.06,54.61 270 top  (outside the outline)
R24  29.85,158.12 270 top  (outside the outline)
R25  22.23,158.12 270 top  (outside the outline)
R26  37.46,158.12 270 top  (outside the outline)
R27  33.66,158.12 270 top  (outside the outline)
R28  50.16,185.42 90 top  (outside the outline)
R29  64.14,141.61 270 top  (outside the outline)
R30  26.67,132.72 270 top  (outside the outline)
R31  56.52,141.61 270 top  (outside the outline)
R32  109.22,99.7 90 top  (outside the outline)
R33  94.62,99.7 270 top  (outside the outline)
R34  83.19,99.7 270 top  (outside the outline)
R35  81.92,71.75 90 top  (outside the outline)
R36  88.9,142.24 270 top  (outside the outline)
R37  92.71,142.88 270 top  (outside the outline)
R38  104.14,142.88 90 top  (outside the outline)
R39  85.09,142.24 270 top  (outside the outline)
R40  52.7,141.61 270 top  (outside the outline)
R41  48.89,141.61 270 top  (outside the outline)
R42  45.09,141.61 90 top  (outside the outline)
R43  90.81,71.75 90 top  (outside the outline)
R44  118.11,84.45 270 top  (outside the outline)
R45  107.95,142.88 90 top  (outside the outline)
R46  118.11,67.94 270 top  (outside the outline)
R47  122.56,88.27 270 top  (outside the outline)
R48  73.03,90.81 270 top  (outside the outline)
R49  69.22,90.81 270 top  (outside the outline)
R50  60.32,90.81 270 top  (outside the outline)
R51  64.14,90.81 270 top  (outside the outline)
R59  71.76,141.61 270 top  (outside the outline)
R60  112.4,127 270 top  (outside the outline)
R61  108.59,127 270 top  (outside the outline)
R62  16.51,120.02 180 top  (outside the outline)
R63  66.04,114.94 270 top  (outside the outline)
R64  52.07,114.94 270 top  (outside the outline)
R65  45.09,114.3 90 top
R66  62.23,114.94 270 top  (outside the outline)
R99  60.32,141.61 270 top  (outside the outline)
R104  25.4,36.83 0 top
R105  23.5,80.01 90 top
R204  92.71,17.14 270 top  (outside the outline)
R205  93.98,3.17 270 top  (outside the outline)
R207  16.51,127.64 180 top  (outside the outline)
R208  16.51,123.83 180 top  (outside the outline)
R209  88.9,185.42 270 top  (outside the outline)
R210  14.61,158.12 270 top  (outside the outline)
R211  101.6,179.7 0 top  (outside the outline)
R212  81.28,185.42 270 top  (outside the outline)
R213  94.62,158.12 270 top  (outside the outline)
R223  54.61,170.81 270 top  (outside the outline)
R224  61.59,185.42 270 top  (outside the outline)
R226  77.47,185.42 270 top  (outside the outline)
R227  73.66,185.42 270 top  (outside the outline)
R229  18.42,158.12 270 top  (outside the outline)
R230  53.98,185.42 270 top  (outside the outline)
R231  57.78,185.42 270 top  (outside the outline)
R236  79.38,158.12 270 top  (outside the outline)
R237  33.02,184.78 270 top  (outside the outline)
R238  36.83,184.78 270 top  (outside the outline)
R239  45.72,185.42 90 top  (outside the outline)
R240  53.34,158.12 90 top  (outside the outline)
R241  57.78,158.12 90 top  (outside the outline)
R242  98.43,158.12 270 top  (outside the outline)
R243  87,158.12 270 top  (outside the outline)
R244  90.81,158.12 90 top  (outside the outline)
R245  83.19,158.12 90 top  (outside the outline)
R246  65.41,185.42 90 top  (outside the outline)
R247  69.22,185.42 270 top  (outside the outline)
R248  102.23,158.12 270 top  (outside the outline)
RAD1  67.95,20.32 0 top  (outside the outline)
RAD2  67.95,19.05 180 top  (outside the outline)
T1  21.59,43.18 270 top
T2  27.94,43.18 270 top
T4  16.51,80.65 90 top
T5  10.16,80.65 90 top
T11  73.03,102.23 270 top  (outside the outline)
T12  67.95,102.23 90 top  (outside the outline)
T14  33.02,127.64 90 top  (outside the outline)
T15  60.96,102.23 90 top  (outside the outline)
T17  20.32,174.62 270 top  (outside the outline)
T18  13.97,174.62 270 top  (outside the outline)
T20  64.77,52.07 90 top  (outside the outline)
T21  69.22,64.77 270 top  (outside the outline)
TR1  29.85,6.35 270 top
TR2  43.81,60.96 180 top
U1  95.25,85.72 180 top  (outside the outline)
U2  40,83.82 90 top
U3  41.91,38.1 90 top
U4  100.33,41.28 180 top  (outside the outline)
U5  92.71,128.91 180 top  (outside the outline)
U6  48.89,128.91 180 top  (outside the outline)
U7  34.29,171.45 180 top  (outside the outline)
U8  81.92,172.09 180 top  (outside the outline)
U9  78.11,5.08 0 top  (outside the outline)
U10  67.95,18.42 0 top  (outside the outline)
U11  14.61,100.97 270 top
U12  26.67,98.42 0 top
U$7  [3,3]  5.63,34.68 0 top
U$8  [3,3]  5.63,155.68 0 top  (outside the outline)
U$9  [3,3]  120.64,159.68 0 top  (outside the outline)
U$10  [3,3]  127.64,34.93 0 top  (outside the outline)
X1  2.54,10.12 270 top
X2  122.56,180.34 180 top  (outside the outline)
X3  5.71,128.91 90 top  (outside the outline)
X4  5.71,141.61 270 top  (outside the outline)
X5  127,106.68 270 top  (outside the outline)
X6  127,123.83 90 top  (outside the outline)
X7  127,59.05 270 top  (outside the outline)
X8  4.45,76.2 90 top
X9  4.45,47.62 270 top

### Tracks (layer width: path | path; a pad name or v marks a point on that pad's centre or on a via)
+12V  (via drill 0.61)
  Top 0.813: U1.14 95.25,84.45 94.62,85.09 77.47,85.09 | C43.2 111.76,175.89 112.4,175.26 112.4,168.28 | 112.4,168.28 112.4,149.22 110.49,147.32 110.49,143.51 | R208.1 22.86,122.56 39.37,122.56 | 80.65,61.59 PP15.1 | 112.4,168.28 v115.57,168.28 | U6.8 52.7,124.46 53.98,123.19 53.98,116.84
  Top 1.016: C22.2 110.49,143.51 110.49,140.34 R45.1 105.41,135.25 | U5.4 92.71,133.99 93.98,135.25 105.41,135.25 | 105.41,135.25 106.05,134.62 106.05,121.28 107.32,118.75 v107.32,111.12 104.78,108.59 90.17,108.59 R8.1 78.11,109.86 73.66,116.84 53.98,116.84 52.7,116.84
  Top 1.27: C5.+ 62.23,55.88 R22.2 | D1.A 68.58,32.39 74.3,26.67 C17.2
  Top 1.422: R27.2 33.66,139.7 39.37,133.99 39.37,122.56 39.37,116.84 | R48.2 73.66,85.09 77.47,85.09 77.47,66.68 80.65,63.5 80.65,61.59 80.65,30.48 C17.2 | R51.1 64.14,97.16 62.86,98.42 54.61,98.42 51.43,101.6 46.99,101.6 39.37,109.22 39.37,116.84 | 39.37,116.84 52.7,116.84
  Bottom 0.813: 59.05,60.33 R18.1 | R22.2 59.05,60.33 | 59.05,60.33 53.98,60.33 | R62.2 15.88,120.02 R208.1 R207.1 | C43.2 93.98,175.89 91.44,173.36 82.55,173.36 81.92,173.99 U8.4 | R26.2 37.46,156.21 41.91,160.66 C46.2 45.09,167.64 | 45.09,167.64 U7.8 | 45.09,167.64 45.72,167.64 P12.1 P12.2 50.16,171.45 50.16,175.89 | 50.16,175.89 R239.1 | 50.16,175.89 R223.1 | 102.87,76.2 U1.17 | C35.1 C34.+ 95.25,79.38 U1.14 | U6.8 C14.2 | v115.57,168.28 P9.1
  Bottom 1.016: P9.1 P9.2 | C35.1 102.87,76.2 | 64.14,89.53 C4.2 | v107.32,111.12 126.37,111.12 X5.1
  Bottom 1.27: C17.2 U10.OUT | TR2.2 53.98,60.33 TR2.5 | C5.+ C16.1 D1.A | R27.2 R26.2
  Bottom 1.422: C17.2 83.19,24.13 C24.+ R204.1 | R48.2 73.03,89.53 64.14,89.53 R51.1
-12V  (via drill 0.61)
  Top 0.813: 78.74,133.99 83.19,129.54 90.17,129.54 92.71,127 U5.11 92.64,125.09 92.64,120.65 | 78.74,133.99 71.76,133.99 64.77,127 55.88,127 53.34,129.54 45.09,129.54 U6.4 | U8.11 81.92,165.1 81.28,164.47 81.28,150.5 83.19,148.59 83.19,138.43 78.74,133.99 | C18.2 81.92,9.53 88.27,15.88 88.27,24.13 83.82,28.58 83.82,55.25 95.25,66.68 108.59,66.68 | 108.59,66.68 113.03,66.68 114.94,68.58 114.94,80.65 124.46,90.17 130.17,90.17 130.17,113.03 123.83,113.03 122.56,111.76 113.03,111.76 v113.03,113.67 | 108.59,66.68 PP16.1 | 92.64,120.65 92.64,120.55 | 92.64,120.65 R7.1
  Bottom 0.406: 81.92,3.81 80.65,3.81 U9.OUT
  Bottom 0.813: 87.63,0.64 D202.K | P13.3 C44.1 95.25,173.99 93.34,171.45 82.55,171.45 81.92,170.81 U8.11 | U6.4 40.64,137.16 C42.1 | R7.1 93.98,118.75 C27.1 99.7,115.57 99.7,111.12 100.97,109.86 102.87,109.86 106.68,113.67 v113.03,113.67
  Bottom 1.27: C18.2 81.92,3.81 U9.OUT 82.39,2.54 86.01,-1.08 | C23.- 90.62,-5.72 90.64,-5.7 86.01,-1.08 | 87.63,0.64 87.63,0.54 86.01,-1.08
D204  (via drill 0.61)
  Top 0.813: v71.12,183.51 86.36,183.51 D204.C
  Bottom 0.813: P14.3 69.22,174.62 71.12,176.53 v71.12,183.51
GND  (1 unrouted)
  Top 0.813: T17.E 18.93,172.09 18.89,172.05 18.85,172.09 T18.E
  Top 1.016: U4.12 99.06,40 100.33,41.28 107.95,41.28 109.22,42.55 U4.1
  Bottom 0.813: C18.1 85.73,8.89 D201.K 93.34,8.89 R205.1 | D31.K 61.59,28.58 C40.1 | P10.1 66.68,168.91 64.77,172.09 61.59,172.09 P14.1 | C22.1 113.67,139.06 P3.1 122.56,139.06 124.46,140.97 | 118.02,53.44 118.11,53.34 | 118.02,53.49 118.02,53.44 | PP17.1 115.57,55.88 118.02,53.44 | 55.88,106.05 46.99,106.05 45.09,107.95 R65.1
  Bottom 1.016: 46.99,85.09 46.99,88.9 43.81,92.08 Q2.4 JP2.1 55.88,95.25 | 46.99,85.09 U2.3 | 46.99,85.09 46.99,76.84 48.26,74.93 48.26,40.64 47.62,39.37 U3.3 | 81.28,194.94 R212.1 R226.1 | 33.02,194.94 R237.1 30.48,187.32 U7.4 27.31,172.09 22.23,172.09 | 22.23,172.09 T17.E | 22.23,172.09 R25.1 | 110.49,168.91 P13.1 C44.2 96.52,168.91 C43.1 | 110.49,160.66 C212.1 | 87,150.5 R243.2 | 88.9,150.5 R36.1 | C46.1 45.09,150.5 R42.2 | 66.04,150.5 C48.- 66.04,130.18 | Q1.4 17.78,135.25 17.78,143.51 C206.1 | C2.1 C1.1 124.46,127.64 X6.4 | 104.78,107.31 C6.1 101.6,102.87 C7.1 | C25.2 C21.1 C26.2 79.38,106.05 | 73.03,106.05 T11.E | 67.95,106.05 T12.E | 59.69,106.05 T15.E | 55.88,106.05 55.88,95.25 | 55.88,95.25 C4.1 | 113.67,107.31 C3.1 | 96.52,107.31 C27.2 | U1.6 92.71,87 93.34,86.36 97.16,86.36 97.79,85.72 U1.15 97.79,84.45 113.67,84.45 | P10.1 C211.1 68.58,160.66 | R21.2 87,50.8 R16.1 | 100.33,150.5 D10.C | 96.52,150.5 C13.2 | R1.1 73.66,120.65 73.03,120.02 R63.1 66.04,130.18 | 66.04,130.18 C14.1
  Bottom 1.27: 67.95,13.97 U10.GND | 68.58,8.89 68.58,7.62 67.95,7.62 | 26.67,144.78 R30.1 T14.E | 113.67,45.09 U4.1 109.22,54.61 108.59,55.25 C15.2 C19.2 102.87,60.33 100.97,62.23 95.89,62.23 R21.2 | 70.48,160.66 C211.1 | 70.48,160.66 C210.1 | 70.48,150.5 70.48,160.66 | 110.49,180.34 X2.3
  Bottom 1.422: 75.57,-1.27 U9.GND | 73.03,12.7 C41.2 | U10.GND 67.95,18.42 | C40.1 C17.1 70.48,25.4 C29.1 | 33.02,194.94 81.28,194.94 92.08,194.94 105.41,183.51 110.49,183.51 110.49,180.34 110.49,168.91 110.49,160.66 110.49,153.03 113.03,150.5 100.33,150.5 96.52,150.5 88.9,150.5 87,150.5 70.48,150.5 66.04,150.5 45.09,150.5 41.27,150.5 40.64,149.86 C42.2 40,144.78 26.67,144.78 C206.1 15.88,147.95 11.43,147.95 8.89,145.41 X4.1 1.91,145.41 1.91,136.53 X3.5 | 55.88,106.05 59.69,106.05 67.95,106.05 73.03,106.05 78.74,106.05 79.06,106.36 | 79.06,106.36 80.01,107.31 96.52,107.31 104.78,107.31 113.67,107.31 116.84,107.31 116.84,104.14 116.84,95.25 113.67,91.44 113.67,84.45 113.67,79.38 115.57,76.84 115.57,75.56 | 131.44,93.34 D5.C | 79.06,106.36 79.38,106.05 | 86.36,66.68 R43.1 95.25,71.12 C34.- C35.2 C30.2 C32.- 115.57,69.85 115.57,75.56 | 86.36,66.68 R35.1 | 86.36,66.68 C33.2 | 118.11,75.56 R46.1 | 118.11,75.56 R44.2 | 115.57,75.56 118.11,75.56 | C29.1 C16.2 C29.1 | T21.S 66.68,55.25 T20.S 70.48,54.61 71.12,53.98 71.12,41.28 | 71.12,40.64 71.12,36.83 C29.1 | 71.12,40.64 71.12,41.28 | 71.12,40.64 C28.- | 71.12,41.28 C5.-
  Bottom 1.676: 131.44,102.87 124.46,102.87 123.19,104.14 P5.3 116.84,104.14
  Bottom 2.184: 67.95,12.7 73.03,12.7 C18.1 81.92,13.97 C24.- | 113.03,150.5 114.94,148.59 124.46,148.59 124.46,140.97 131.44,133.99 131.44,123.83
  Bottom 2.54: TR1.4 33.53,-8.38 33.66,-8.25 TR1.5 33.66,-12.06 35.56,-13.97 75.05,-13.97 | 75.05,-13.97 C203.+ | 79.24,-13.97 90.5,-13.97 C23.+ | 79.24,-13.97 75.05,-13.97 | 67.95,13.97 67.95,12.7 67.95,7.62 67.95,6.98 C202.- 72.39,-1.27 75.57,-1.27 79.24,-1.27 79.24,-13.97 | 67.95,18.42 67.95,23.5 | C24.- 95.25,17.14 97.16,19.05 97.16,32.39 113.67,32.39 113.67,45.09 113.67,50.8 118.02,53.49 X7.2 131.44,59.05 131.44,93.34 131.44,102.87 131.44,123.83 X6.3 X6.4
N$1
  Bottom 0.813: C212.2 102.23,160.02 R248.1 R242.1
N$2
  Top 0.61: U1.1 105.41,87 80.65,87 77.47,90.17 71.76,90.17 70.48,91.44 70.48,109.22 PP2.1
  Bottom 0.61: 66.68,109.22 R63.2
  Bottom 0.813: PP2.1 66.68,109.22 | R66.1 62.23,118.11 66.04,114.3 R63.2
N$3
  Top 0.813: U7.2 35.56,177.17 34.92,177.8 34.92,184.01 51.93,184.01 52.07,182.88 52.07,179.07 53.34,177.8 69.85,177.8 70.48,177.17 70.48,167.64 72.39,165.74 79.38,165.74 R236.1
N$4
  Top 0.813: U7.5 30.48,170.18 31.75,171.45 40,171.45 41.27,170.18 R9.1
N$5
  Bottom 0.813: U7.6 33.02,166.37 R24.1 29.85,160.66 29.21,160.02 | R25.2 29.21,160.02 | R26.1 37.46,161.93 35.56,160.02 29.21,160.02
N$6
  Bottom 0.813: D4.A R24.2
N$7
  Bottom 0.813: X3.1 5.71,121.92 | 5.71,121.92 X3.2 | 5.71,121.92 R208.2
N$8
  Bottom 0.813: R204.2 88.9,12.06 D201.A
N$9
  Top 0.813: R28.2 50.16,193.46 23.07,193.46 T18.C
N$10
  Bottom 1.016: R210.1 9.5,169.55 9.5,174.62 T18.B
N$11
  Bottom 0.813: R27.1 35.56,165.1 U7.7 35.56,170.18 28.58,170.18 26.04,167.64 D4.C 26.04,160.66 R229.2 R210.2
N$12
  Bottom 0.813: X3.3 8.26,128.91 D203.A
N$13
  Bottom 0.813: R32.1 108.59,95.25 C6.2 102.87,93.34 U1.2 U1.3
N$14
  Bottom 0.813: C7.2 97.79,93.98 U1.4
N$15
  Bottom 0.813: C3.2 109.22,100.97 R32.2
N$16  (via drill 0.61)
  Top 0.813: v126.37,97.79 123.19,97.79 120.02,94.62 117.48,94.62 115.57,92.71 91.44,92.71 90.17,91.44 U1.7
  Bottom 0.813: U1.7 90.17,92.08 87,95.25 C21.2 | v126.37,97.79 122.56,101.6
  Bottom 1.016: 122.56,101.6 P5.2
N$17
  Bottom 0.813: U1.5 95.25,94.62 R33.2 92.71,94.62 C25.1 88.9,98.42 76.84,98.42 76.2,97.79 76.2,93.34 74.93,92.08 67.95,92.08 66.68,93.34 66.68,97.16 62.86,100.97 T15.C
N$18  (via drill 0.61)
  Top 0.813: v76.2,87.63 69.85,87.63 66.04,91.44 66.04,99.06 64.14,100.97 64.14,106.05 62.86,107.31 50.8,107.31 48.89,109.22 v48.89,109.86
  Bottom 0.813: U1.8 87.63,91.44 85.73,93.34 84.45,93.34 R34.2 81.28,94.62 C26.1 79.38,90.81 v76.2,87.63 | T14.C 34.29,124.46 34.54,124.46 42.8,116.2 47.37,116.2 48.89,114.68 v48.89,109.86
N$19  (via drill 0.61)
  Top 0.813: v109.86,87.63 109.86,86.36 U1.18
  Bottom 0.813: R34.1 R33.1 94.62,100.33 96.52,98.42 107.95,98.42 111.76,94.62 111.76,89.53 v109.86,87.63 | C32.+ 111.12,76.2 C30.1 107.32,80.01 U1.18
N$20
  Bottom 0.813: U1.9 83.19,89.53 81.92,88.27 R35.2
N$21
  Top 0.813: R230.1 53.98,193.68 93.34,193.68 104.14,184.15
  Top 1.016: 104.14,184.15 121.29,184.15 122.56,182.88 X2.2
N$22
  Bottom 0.813: R212.2 84.45,177.17 U8.3
N$23
  Bottom 0.813: U1.10 85.09,76.84 C33.1
N$24
  Bottom 0.813: U1.11 87.63,80.01 R43.2
N$25
  Bottom 0.813: D21.C R66.2
N$26
  Bottom 0.813: D208.A 41.27,187.96 36.83,183.51 R238.2
N$27
  Bottom 0.813: R65.2 U6.5
N$28
  Bottom 1.422: TR2.9 32.38,64.77 D2.C
N$29
  Bottom 0.813: X7.1 D8.C D9.A 118.11,64.77 R46.2
N$30
  Bottom 1.422: TR2.7 D3.A
N$31
  Top 0.813: R230.2 53.98,187.06 25.4,187.06 T17.C
  Bottom 0.813: R230.2 R231.2
N$32
  Bottom 1.016: P9.3 123.19,172.09 126.37,175.26 X2.1
N$33
  Bottom 0.813: P10.3 56.52,167.64 R223.2
N$34
  Bottom 0.813: U8.5 79.38,185.42 75.57,189.23 75.57,192.41 69.22,192.41 | 69.22,192.41 61.59,192.41 R224.1 R231.1 | 69.22,192.41 R247.1
N$35
  Bottom 0.813: U8.6 76.84,179.7 R226.2 77.47,184.15 73.66,187.96 R227.1
N$36
  Top 0.813: U3.2 49.53,36.83 50.8,35.56 R13.2
N$37
  Bottom 0.813: R205.2 93.98,1.27 92.08,3.17 D202.A
N$38
  Bottom 0.813: U8.13 87,166.37 87.63,165.1 89.54,165.1 R244.2 90.81,160.66 R242.2
N$39
  Bottom 0.813: U8.12 84.45,166.37 R243.1
N$40
  Top 0.813: R240.1 53.34,155.57 48.26,160.66 D209.C
N$41
  Top 0.813: U8.14 89.54,165.74 88.9,165.1 88.9,154.94 R244.1
  Bottom 0.813: R213.2 R244.1 83.19,160.66 R245.2
N$42
  Bottom 0.813: C210.2 79.38,155.57 R236.2 R245.1
N$43
  Bottom 0.813: R12.1 50.8,74.93 50.16,74.3 50.16,44.45 R13.1 53.34,41.28 R14.2 | U1.13 92.71,78.11 94.62,76.2 94.62,74.3 90.81,71.75 81.92,71.75 72.39,81.28 PP1.1
  Bottom 1.016: PP1.1 54.61,81.28 R12.1
N$44
  Top 1.016: R240.2 52.07,163.19 51.43,163.83 51.43,176.53 50.8,177.17 44.45,177.17 D208.C
  Bottom 0.813: R239.2 45.72,186.69 41.27,182.25 D208.C 41.27,178.44 U7.1 | R240.2 R241.2
N$45
  Bottom 0.813: R238.1 36.83,187.96 33.02,184.15 R237.2 U7.3 33.02,172.72 42.54,172.72 44.45,173.99 P12.3
N$46
  Bottom 0.813: 57.78,155.57 C211.2 | 57.78,155.57 R241.1 | 57.78,155.57 48.26,155.57 D209.A 48.26,158.12 43.81,158.12 41.27,155.57 R9.2
N$47
  Bottom 0.813: R224.2 61.59,179.07 58.42,175.89 58.42,172.09 60.32,170.18 63.5,170.18 64.14,169.55 P10.2
N$49
  Bottom 0.813: R229.1 18.42,168.01 15.63,170.8 15.63,173.8 16.39,174.55 18.89,174.55 18.96,174.62 T17.B
N$50
  Bottom 0.813: R211.2 107.32,179.7 107.95,179.07 107.95,172.09 107.32,171.45 P13.2
N$51
  Top 0.813: U8.2 87,173.99 88.27,172.72 90.17,172.72 94.62,168.28 R213.1
  Bottom 0.813: 87,190.5 D210.A | 87,190.5 R209.1 88.9,189.87 96.52,182.25 R211.1 | U8.2 87,190.5
N$52
  Bottom 1.422: D6.C 30.48,58.42 TR2.10
N$54
  Top 0.813: D210.C R209.2
  Bottom 0.813: 89.54,179.7 U8.1 | R209.2 89.54,179.7 | 89.54,179.7 D204.A
N$55
  Bottom 0.813: R246.1 65.41,178.44 64.14,177.17 P14.2
N$56
  Bottom 0.813: R28.1 50.16,182.88 65.41,182.88 | 65.41,182.88 68.58,182.88 69.22,182.25 R247.2 | 65.41,182.88 R246.2
N$57
  Bottom 0.813: D8.A D5.A
N$58
  Top 0.813: R6.1 67.95,140.34 67.31,139.7 57.78,139.7 56.52,138.43 R31.2
  Bottom 0.813: DZ2.A R64.2 52.07,116.2 47.62,120.65 U6.6 47.62,127.64 48.26,128.27 55.24,128.27 56.52,129.54 R31.2 | R6.1 R59.1
N$59
  Bottom 1.422: TR2.12 D7.A
N$60
  Bottom 1.016: R18.2 C20.2
N$61
  Top 1.016: U3.7 R104.2
  Bottom 1.016: U3.6 U3.7 | C54.1 30.48,34.92 R104.2
N$62
  Bottom 0.813: TR2.6 C20.1
  Bottom 1.27: T21.D 62.86,64.77 56.52,71.12 TR2.6
N$63
  Bottom 0.813: P2.1 91.44,112.39 92.71,111.12 R7.2
N$64
  Bottom 0.813: D9.C R47.2 118.11,87.63 R44.1
N$65
  Bottom 0.813: TR2.1 C39.2
  Bottom 1.27: TR2.1 55.24,52.07 T20.D
N$66
  Bottom 0.813: R22.1 59.05,45.72 C39.1
N$67
  Bottom 0.61: R21.1 96.52,48.9 U4.6
N$68
  Bottom 1.016: R2.1 T20.G
N$69
  Bottom 0.813: P5.1 122.56,97.16 R47.1
N$70
  Bottom 1.016: T21.G R10.1
N$71
  Bottom 0.813: R16.2 88.27,34.92 92.71,34.92 93.98,36.2 U4.10
N$72
  Bottom 0.813: U4.11 96.52,40 81.92,40 R2.2
N$73  (via drill 0.61)
  Top 0.813: v42.54,113.03 73.03,113.03 74.93,108.59 74.93,106.68 | 74.93,106.68 T11.C | 74.93,106.68 107.32,106.68 108.59,107.95 122.56,107.95 123.83,106.68 X5.2
  Bottom 0.813: X3.4 3.17,132.72 1.27,131.44 1.27,120.02 4.45,116.84 38.73,116.84 v42.54,113.03
N$74
  Bottom 0.813: D21.A DZ2.C R64.1 50.16,121.92 U6.7
N$75
  Bottom 0.813: T12.C T11.B R48.1
N$76
  Bottom 0.813: T12.B 66.04,100.33 69.22,97.16 R49.1
N$77
  Bottom 0.813: T15.B 59.05,97.16 R50.1
N$78
  Top 0.813: R50.2 55.88,85.72 53.98,87.63 53.98,95.89 52.07,97.79 JP2.2
  Bottom 0.813: Q2.5 JP2.2
  Bottom 1.016: R49.2 R51.2 R50.2
N$79
  Bottom 1.27: TR1.3 18.67,-4.83 20.96,-2.54 61.59,-2.54 M1.AC1
N$80
  Bottom 1.27: TR1.6 44.32,-8.38 46.35,-6.35 53.34,-6.35 M1.AC2
N$81
  Bottom 1.27: X1.3 19.01,6.31 33.66,20.95 40.64,20.95 40.77,21.08 TR1.1
N$82
  Bottom 1.27: X1.1 14.56,13.93 18.42,17.78 18.42,20.95 18.54,21.08 TR1.2
N$85
  Bottom 0.813: D20.C 74.93,143.51 71.76,140.34 R59.2
N$88
  Bottom 1.016: D31.A R14.1
N$90
  Bottom 0.813: U4.14 104.14,40 102.23,41.91 85.09,41.91 R10.2
N$96
  Bottom 0.813: R6.2 68.58,136.53 JP1.2
N$97
  Bottom 0.813: R39.1 81.28,147.32 C12.2
N$98
  Bottom 0.813: 102.82,118.11 P4.1 102.87,118.06 | JP1.1 85.11,123.83 85.14,123.8 85.14,125.05 U5.8 85.09,122.3 98.64,122.3 102.87,118.06 | 102.87,118.06 102.89,118.05
N$99
  Bottom 0.813: R38.2 R45.2 109.22,146.05 118.11,146.05 P3.3 P3.2
N$100  (via drill 0.61)
  Top 0.813: v110.49,115.57 110.49,130.18 R61.1
  Bottom 0.61: U5.9 87.63,125.73 90.81,128.91 107.32,128.91 108.59,130.18 R61.1
  Bottom 0.813: P4.3 P4.2 v110.49,115.57
N$101
  Bottom 0.813: R8.2 84.45,120.02 P2.3
N$103
  Bottom 0.813: C2.2 R4.1 115.57,123.83 R60.2
N$104
  Top 0.61: R5.2 77.47,127.64 88.9,127.64 90.17,126.37 U5.10
  Bottom 0.61: U5.10 90.17,126.37 91.44,127.64 111.12,127.64 112.4,128.91 R60.1
  Bottom 0.813: R1.2 R5.2
N$105
  Bottom 0.813: P2.2 78.74,114.94 77.47,116.2 R5.1
N$107
  Bottom 0.813: X6.1 121.92,116.2 120.65,114.94 R3.2
N$108
  Bottom 0.813: 92.71,143.51 R37.1 | 85.09,143.51 78.11,143.51 D19.A | 85.09,143.51 92.71,143.51 | 85.09,143.51 R39.2 87.63,134.62 U5.6 | R38.1 104.14,142.24 102.87,143.51 92.71,143.51
N$110
  Bottom 0.813: D20.A D19.C 80.65,137.16 81.28,136.53 | 81.28,136.53 U5.7 | 81.28,136.53 C12.1
N$112
  Bottom 0.61: C19.1 99.7,50.16 R23.2 U4.5
N$113
  Bottom 0.813: 63.5,136.53 R99.2 | 63.5,136.53 R29.2 | C48.+ 63.5,136.53
N$114
  Bottom 0.813: R36.2 90.17,135.89 U5.5
N$115
  Bottom 0.813: R99.1 60.32,147.32 59.05,148.59 50.16,148.59 48.89,147.32 R41.1
N$116
  Bottom 0.813: U6.2 50.16,135.89 R41.2 48.89,140.97 52.7,144.78 R40.1
N$117
  Bottom 0.813: U6.3 47.62,134.62 R42.1
N$118
  Bottom 0.813: U6.1 R40.2 52.7,140.34 56.52,144.15 R31.1
N$120
  Bottom 0.813: R30.2 T14.B | Q1.5 23.5,137.8 26.67,133.35 R30.2 | R62.1 25.4,120.02 26.67,121.28 R30.2
N$121  (via drill 0.61)
  Top 0.813: R29.1 64.14,151.13 62.23,153.03 62.23,163.19 v69.85,163.19
  Bottom 0.813: R227.2 74.3,179.7 U8.7 71.76,173.36 71.76,164.47 70.48,163.19 v69.85,163.19
N$123
  Bottom 0.61: U4.16 109.22,40 106.68,42.55 U4.2 C15.1
N$126
  Bottom 0.61: R23.1 99.06,58.42 93.98,53.34 U4.7
N$131
  Top 0.813: Q1.1 15.88,140.34 16.51,139.7 16.51,133.35 18.42,131.44 | 18.42,131.44 D203.C | R207.2 14.61,127.64 18.42,131.44
N$132
  Bottom 0.813: Q1.2 10.16,137.8 X4.2
  Bottom 1.016: Q1.2 15.24,137.8 15.24,143.51 C206.2
N$133
  Bottom 0.813: U4.15 106.68,35.56 106.05,34.92 102.23,34.92 101.6,35.56 | 101.6,35.56 U4.13 | 101.6,35.56 100.97,34.92 95.89,34.92 93.34,32.39 D1.C
  Bottom 1.27: C28.+ C29.2 75.57,33.02 D1.C
N$139
  Bottom 0.813: R20.1 6.98,93.98 7.3,94.3 | 7.3,94.3 D30.C | 7.3,94.3 8.89,92.71 C38.1 13.33,94.62 13.33,102.23 U11.2
N$140
  Top 1.27: T4.2 20.96,80.65 20.96,85.72 24.13,88.9 U12.IN
  Bottom 1.016: U2.8 C8.2 31.12,74.93 29.85,73.66 26.67,73.66 24.13,71.37 D3.C
  Bottom 1.27: U12.IN 22.23,95.89 32.2
  Bottom 1.422: D3.C 17.78,72.39 C10.+ 20.96,76.2 20.96,80.65 T4.2
N$141
  Top 1.422: T5.2 14.61,80.65 14.61,76.2 12.06,73.66 12.06,69.22 14.61,69.22 D2.A
  Bottom 1.016: U2.5 32.38,87.63 C8.1 29.21,87 16.51,87 13.97,84.45 13.97,80.65 T5.2
  Bottom 1.422: D2.A 18.42,65.41 C11.-
N$142
  Bottom 0.813: R15.2 26.67,106.05 R11.2 19.69,104.78 U11.8
  Bottom 1.27: R11.2 27.94,101.6 29.21,100.33 U12.OUT 29.21,92.71 C31.1
N$143
  Bottom 0.813: R11.1 34.29,101.6 Q2.1
N$144
  Top 0.813: Q2.2 31.75,97.79 27.94,101.6 27.94,104.78 23.5,109.22 R17.2
  Bottom 0.813: U11.1 10.79,108.59 11.43,109.22 R17.2
N$145
  Bottom 0.813: R17.1 3.81,109.22 5.08,107.95 | 5.08,107.95 P15.1 6.35,104.14 8.26,102.23 8.26,100.33 8.89,99.7 U11.3 | R15.1 19.69,109.22 16.51,109.22 13.97,111.76 8.89,111.76 5.08,107.95
N$146
  Bottom 0.813: U11.4 8.89,97.16 6.98,99.06 P15.3
  Bottom 1.422: 9.53,67.94 C10.- X8.1 1.27,72.39 1.27,86.36 | 9.53,67.94 C11.+ | TR2.8 33.02,67.94 9.53,67.94 | 7.62,86.36 D30.A | 1.27,86.36 7.62,86.36 | 7.62,86.36 7.62,87.63 C38.2 14.61,88.9 20.32,88.9 32.1 C31.2 U12.GND | P15.2 P15.3 3.17,99.06 1.27,97.16 1.27,86.36
N$147
  Bottom 1.016: U2.6 U2.7 29.21,82.55 27.31,80.65 C53.1 R105.1
N$148
  Top 1.016: T5.3 11.43,83.19 17.53,83.19 T4.3
  Bottom 1.016: C53.2 25.4,83.82 R105.2 21.59,83.19 17.78,83.19 T4.3
N$149
  Bottom 0.813: R20.2 X8.3
N$151
  Bottom 1.422: T4.1 11.43,78.11 T5.1 9.27,76.2 X8.2
N$152
  Bottom 0.813: X6.2 120.02,120.02 116.84,116.84 R4.2
N$153
  Top 1.016: U2.2 48.89,82.55 50.8,84.45 R12.2
N$155
  Bottom 1.422: C36.- 10.16,49.53 C37.+ | TR2.11 33.02,53.98 14.61,53.98 C37.+ | X9.1 5.08,52.07 C37.+
N$157
  Bottom 1.016: T1.2 22.86,43.18 23.5,42.55 23.5,38.73 24.13,38.1 27.94,38.1 31.12,40 C9.1 36.2,34.29 U3.8
  Bottom 1.422: D7.C 17.15,50.8 15.24,48.9 C36.+ 15.24,44.45 16.51,43.18 T1.2
N$158
  Top 1.422: T2.2 24.13,43.18 23.5,43.82 23.5,52.7 D6.A
  Bottom 1.016: T2.2 30.48,43.18 C9.2 35.56,41.91 U3.5
  Bottom 1.422: D6.A C37.-
N$160  (1 unrouted)
  Top 1.422: 19.69,45.72 20.32,45.72 17.15,48.9 5.71,48.9 X9.2
  Bottom 1.422: T1.1 20.32,45.72 20.57,45.47 T2.1
N$162
  Top 1.016: T2.3 26.67,40.64 20.57,40.64 T1.3
  Bottom 1.016: T1.3 R104.1 24.13,33.02 C54.2
N$167
  Bottom 1.27: M1.+ 61.59,-7.62 66.04,-7.62 67.95,-5.72 67.95,-1.91 C202.+ 60.96,11.43 U10.IN C40.2
N$168
  Top 1.422: U9.IN 78.11,-1.27 77.47,-1.91 72.39,-1.91 M1.-
  Bottom 1.016: M1.- 69.22,-10.16 C203.-
  Bottom 1.422: C41.1 U9.IN
R30
  Bottom 0.813: C1.2 R3.1 120.65,123.19 115.57,119.38 111.12,119.38 R61.2
XE6
  Top 0.813: R248.2 102.23,139.7 D10.A
  Bottom 0.813: X6.5 126.37,131.44 123.19,134.62 102.87,134.62 102.87,135.25 D10.A C13.1 R37.2